# EAGLE design Active_Bandpass_Filter_reference_power (EAGLE 7.5.0)
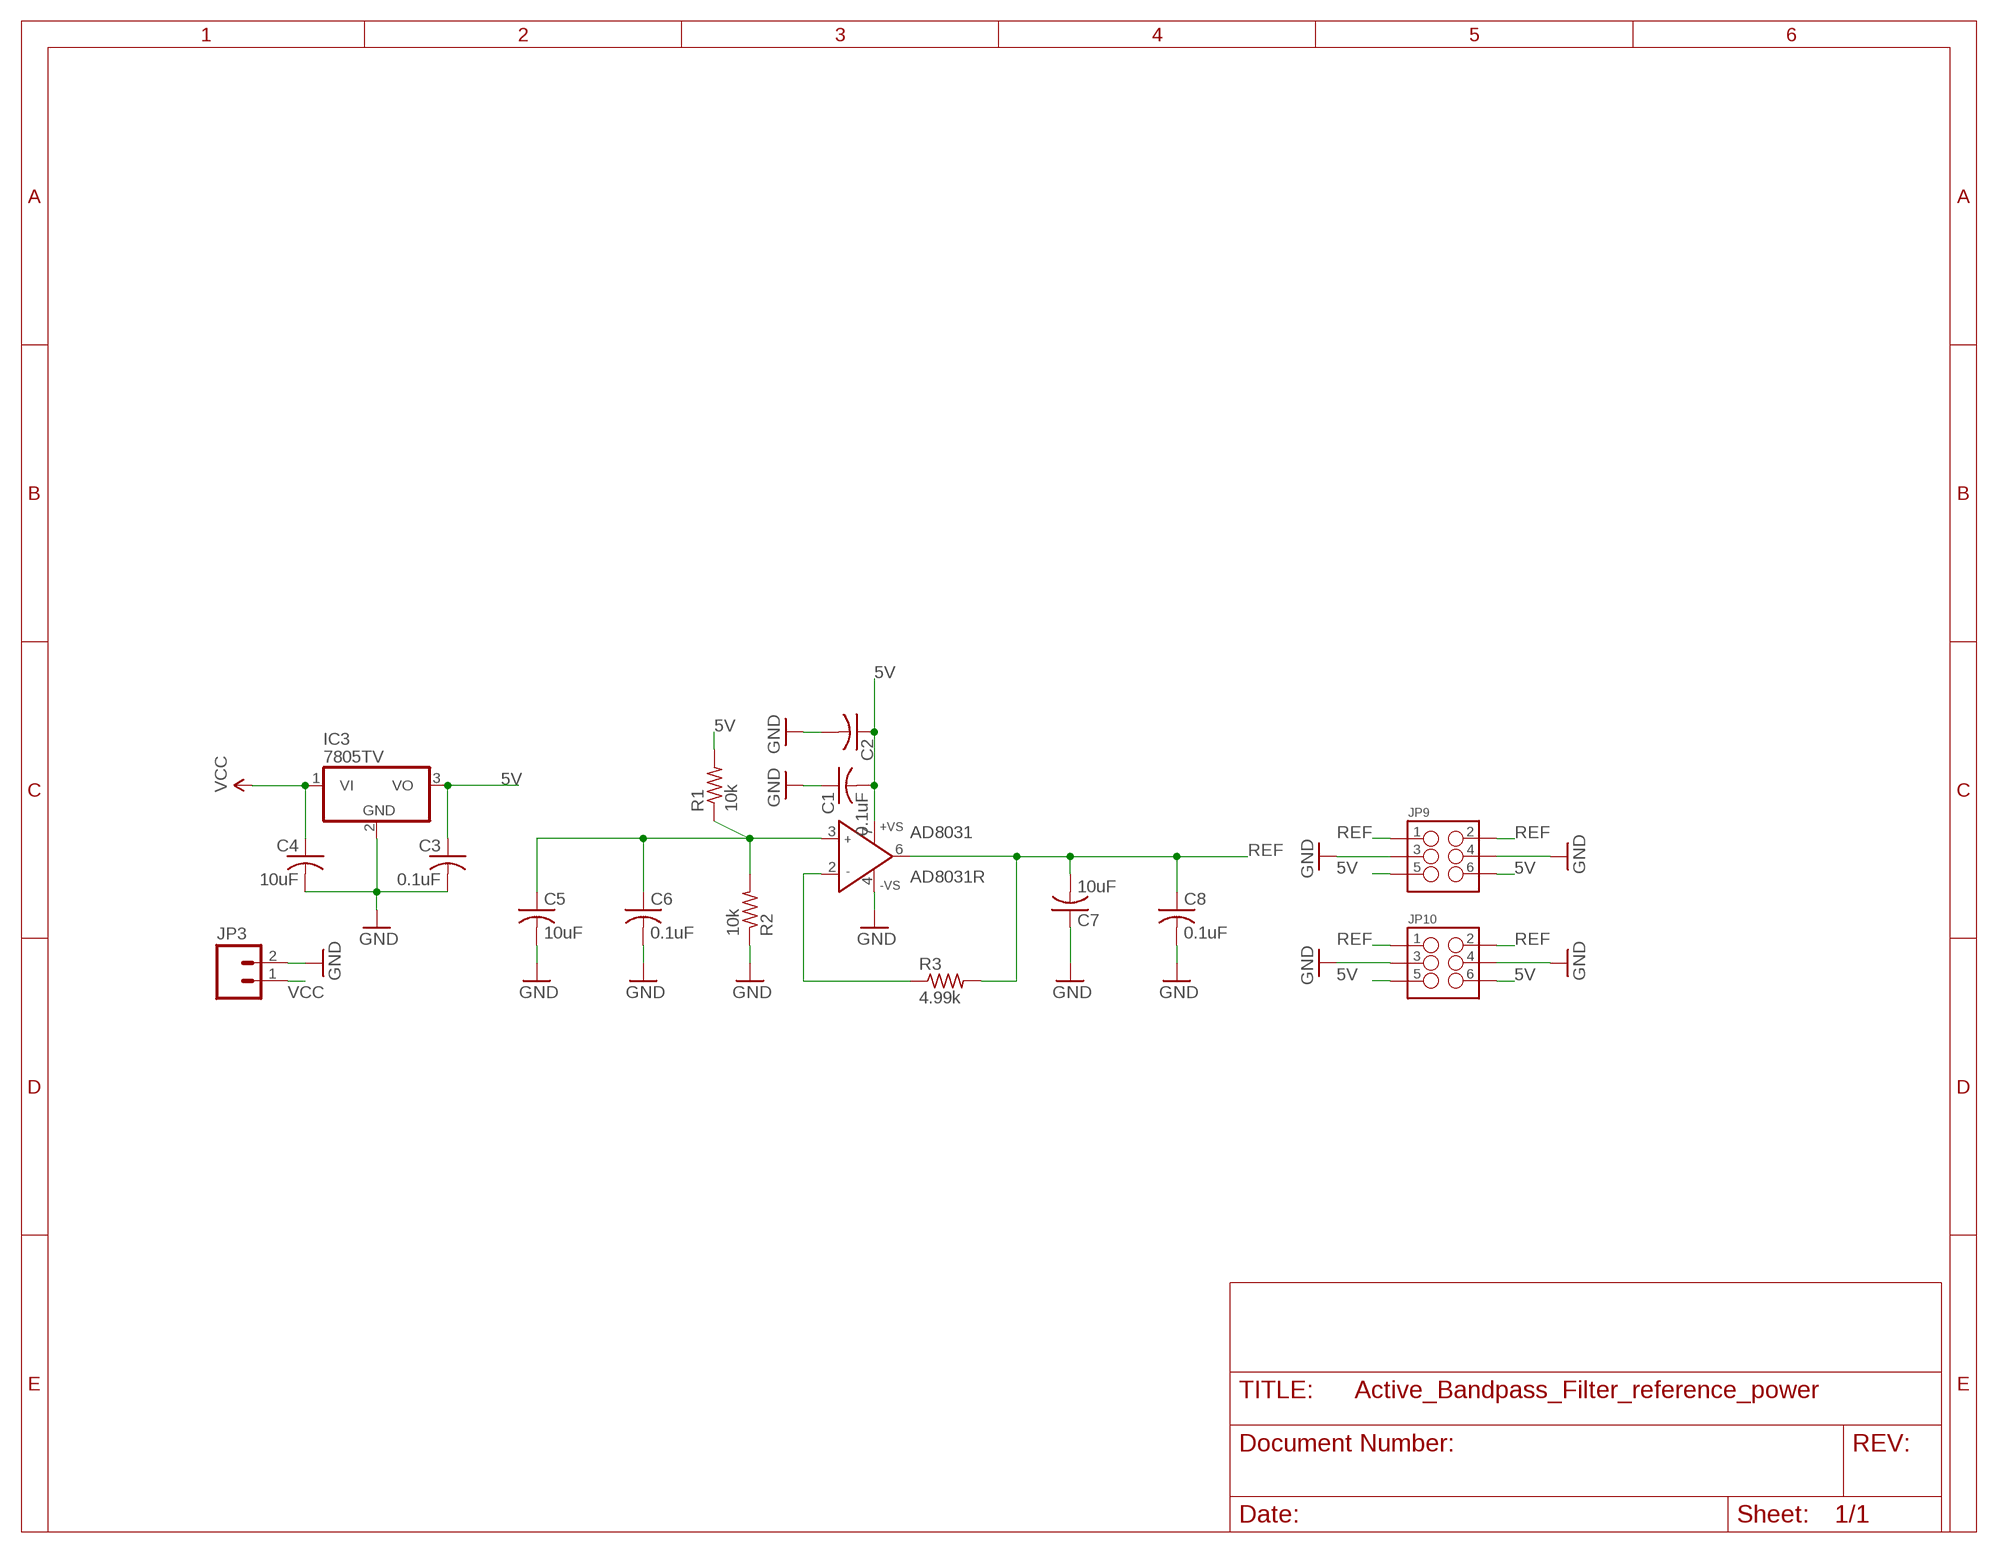
[diagram p0: schematic, sheet 1]

## Parts
AD8031  AD8031R  [SO8]
C1  0.1uF  C-USC1206  [C1206]
C2  C-USC1206  [C1206]
C3  0.1uF  C-USC1206  [C1206]
C4  10uF  C-USC1206  [C1206]
C5  10uF  C-USC1206  [C1206]
C6  0.1uF  C-USC1206  [C1206]
C7  10uF  C-USC1206  [C1206]
C8  0.1uF  C-USC1206  [C1206]
IC3  7805TV  [TO220V]
JP3  M02LOCK_LONGPADS  [1X02_LOCK_LONGPADS]
JP9  M03X22X3_SILK_MALE_PTH  [2X3]
JP10  M03X22X3_SILK_MALE_PTH  [2X3]
R1  10k  R-US_R1206  [R1206]
R2  10k  R-US_R1206  [R1206]
R3  4.99k  R-US_R1206  [R1206]

## Nets
5V: AD8031.7(+VS) C1.2 C2.1 C3.1 IC3.3(VO) JP9.5 JP9.6 JP10.5 JP10.6 R1.2
C5: AD8031.3(IN+) C5.1 C6.1 R1.1 R2.2
GND: AD8031.4(-VS) C1.1 C2.2 C3.2 C4.2 C5.2 C6.2 C7.1 C8.2 IC3.2(GND) JP3.2 JP9.3 JP9.4 JP10.3 JP10.4 R2.1
N$12: AD8031.2(IN-) R3.1
REF: AD8031.6(OUT) C7.2 C8.1 JP9.1 JP9.2 JP10.1 JP10.2 R3.2
VCC: C4.1 IC3.1(VI) JP3.1

## Library data of the parts
AD8031 = analog-devices:AD8031: 2.7 V, 800 ?A, 80 MHz Rail-to-Rail I/O Amplifiers Source: http://www.analog.com/static/imported-files/data_sheets/AD8031_8032.pdf; MPN: AD8031ARZ; OC_FARNELL: 8621500; OC_NEWARK: 19M0917
C1-C8 = resistor:C-US: CAPACITOR, American symbol
IC3 = linear:78*: Positive VOLTAGE REGULATOR Source: http://cache.national.com/ds/LM/LM78L05.pdf http://www.fairchildsemi.com/ds/LM/LM7805.pdf
JP3 = SparkFun-Connectors:M02: Standard 2-pin 0.1" header. Use with - straight break away headers ( PRT-00116) - right angle break away headers (PRT-00553) - swiss pins (PRT-00743) - machine pins (PRT-00117) - female headers (PRT-00115) Molex polarized connector foot print use with: PRT-08233 with associated crimp pins and housings. 2.54_SCREWTERM for use with PRT-10571. 3.5mm Screw Terminal footprints for PRT-08084 5mm Screw Terminal footprints for use with PRT-08432
JP9 JP10 = SparkFun-Connectors:M03X2: 2x3 .1" header. Shrouded, with keying- CONN-10681 SMT- CONN-11415 Pogo pins- HW-11044; PROD_ID: CONN-09701
R1 R2 = resistor:R-US_: RESISTOR, American symbol
R3 = rcl:R-US_: RESISTOR, American symbol

## Board
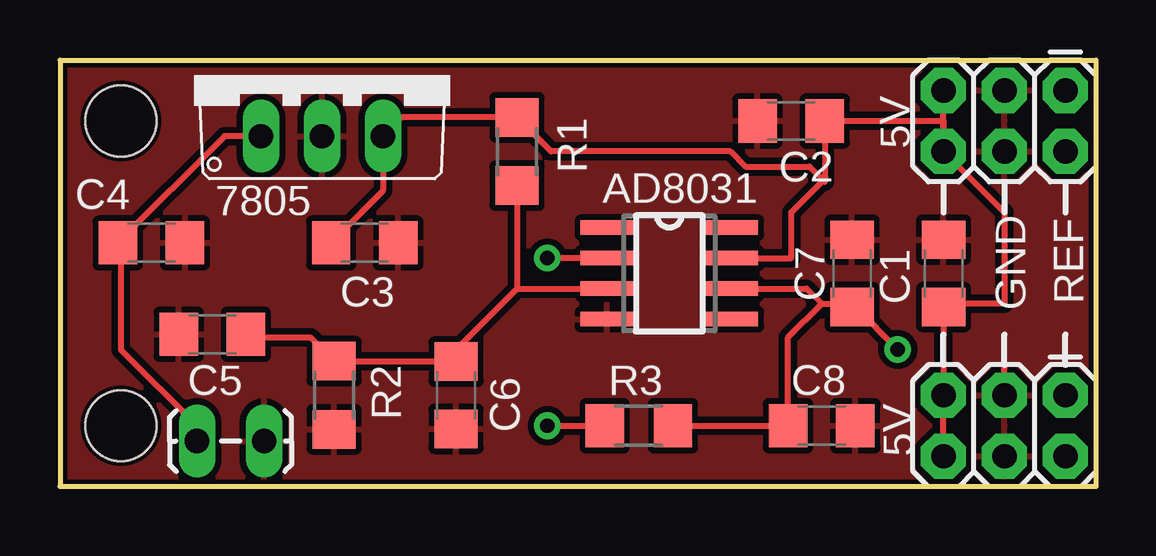
[diagram p1: board, top side]
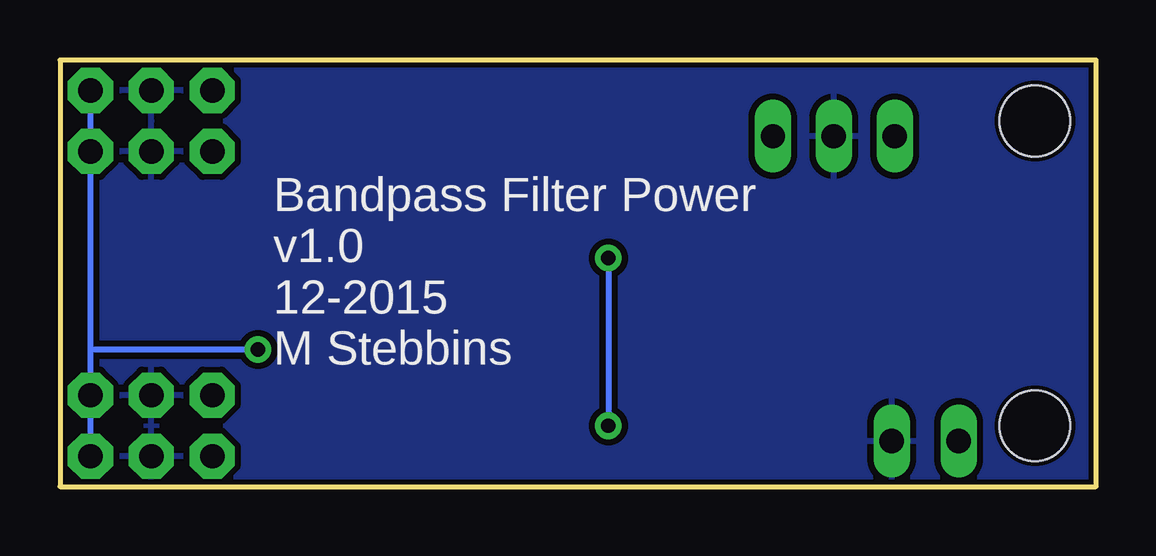
[diagram p2: board, bottom side, seen from below]

Size 43.18 x 17.78 mm. Coordinates in mm from the lower left corner, seen from the top.
Outline: 0,17.78 0,0 43.18,0 43.18,17.78 0,17.78
Copper layers (1*16): Top 0.035mm / dielectric 1.5mm / Bottom 0.035mm
Design rules "SparkFun-2-layer-STANDARD": minimum track width 10mil, minimum drill 20mil, track to track 10mil, track to pad 8mil, pad to pad 8mil, via to via 10mil, smd to smd 8mil, copper to edge 8mil, drill to drill 8mil, minimum pad ring 10mil, minimum via ring 10mil, stop-mask expansion 4mil, vias tented up to drill 20mil, thermal gap 10mil
Holes 2.95 mm at 2.54,15.24 2.54,2.54

### Footprints (pad centres in the part's own frame; a part is rotated, then mirrored left to right if it is on the bottom)
SO8 = smd 0.6 x 2.2: 1 -1.905,-2.6; 2 -0.635,-2.6; 3 0.635,-2.6; 4 1.905,-2.6; 5 1.905,2.6; 6 0.635,2.6; 7 -0.635,2.6; 8 -1.905,2.6
C1206 = smd 1.6 x 1.8: 1 -1.4,0; 2 1.4,0
TO220V = drill 1.016 long: 1 -2.54,-2.54; 2 0,-2.54; 3 2.54,-2.54
1X02_LOCK_LONGPADS = drill 1.016 long: 1 -0.127,0; 2 2.667,0
2X3 = drill 1.016 pad 1.88 octagon: 1 0,0; 2 0,2.54; 3 2.54,0; 4 2.54,2.54; 5 5.08,0; 6 5.08,2.54
R1206 = smd 1.6 x 1.803: 1 -1.422,0; 2 1.422,0

### Placement (x,y rotation side)
AD8031  25.4,8.89 270 top
C1  36.83,8.89 270 top
C2  30.48,15.24 180 top
C3  12.7,10.16 0 top
C4  3.81,10.16 0 top
C5  6.35,6.35 180 top
C6  16.51,3.81 270 top
C7  33.02,8.89 270 top
C8  31.75,2.54 0 top
IC3  10.92,17.14 0 top
JP3  5.84,1.91 0 top
JP9  41.91,16.51 180 top
JP10  41.91,3.81 180 top
R1  19.05,13.97 90 top
R2  11.43,3.81 90 top
R3  24.13,2.54 0 top

### Tracks (layer width: path | path; a pad name or v marks a point on that pad's centre or on a via)
5V
  Top 0.254: JP10.6 JP10.5 | JP9.6 JP9.5 | JP9.6 36.83,15.24 C2.1 31.88,12.7 31.82,12.77 | 31.82,12.77 31.25,13.34 28.57,13.34 27.94,13.97 20.47,13.97 R1.2 14.25,15.39 IC3.3 13.46,12.32 C3.1 | JP10.5 36.83,4.57 | AD8031.7 30.48,9.53 30.48,11.43 31.82,12.77 | JP10.5 C1.2 36.96,7.62 39.37,7.62 39.37,11.43 JP9.6
C5
  Top 0.254: C5.1 7.75,6.22 10.44,6.22 R2.2 16.49,5.23 C6.1 16.51,5.71 19.05,8.26 | R1.1 19.05,8.26 | 19.05,8.26 AD8031.3
GND
  Top 0.254: JP10.3 39.37,4.95
  pour Top: 0,0 0,17.78 43.18,17.78 43.18,0
  pour Bottom: 0,0 0,17.78 43.18,17.78 43.18,0
N$12  (via drill 0.6)
  Top 0.254: AD8031.2 v20.32,9.53 | v20.32,2.54 R3.1
  Bottom 0.254: v20.32,9.53 v20.32,2.54
REF  (via drill 0.6)
  Top 0.254: R3.2 C8.1 30.35,6.22 31.75,7.62 | 31.75,7.62 32.89,7.62 C7.2 33.15,7.49 v34.92,5.71 | AD8031.6 31.11,8.26 31.75,7.62
  Bottom 0.254: JP9.1 JP9.2 41.91,5.71 | 41.91,5.71 JP10.1 JP10.2 | v34.92,5.71 41.91,5.71
VCC
  Top 0.254: IC3.1 6.86,14.61 C4.1 2.54,10.03 2.54,5.71 5.71,2.54 JP3.1

### Text on the board
tPlace: 5V | AD8031 | 7805 | REF | GND | 5V
bPlace: Bandpass Filter Power / v1.0 / 12-2015 / M Stebbins